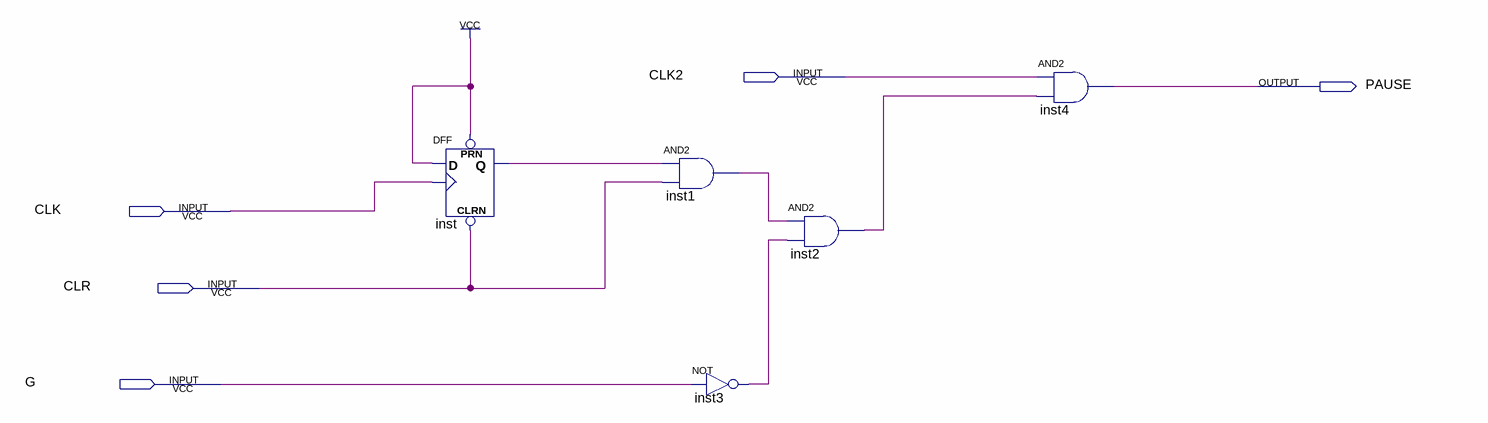
[diagram p0: schematic sheet]
// Quartus schematic maichong.bdf as structural Verilog: 5 symbols, 5 pins
module maichong (
  input  CLK2,
  input  CLK,
  input  CLR,
  input  G,
  output PAUSE
);

  wire inst1_out, inst2_out, inst3_out, inst_q;

  DFF inst (.CLRN(CLR), .CLK(CLK), .D(1'b1), .PRN(1'b1), .Q(inst_q));
  and inst1 (inst1_out, inst_q, CLR);
  not inst3 (inst3_out, G);
  and inst2 (inst2_out, inst1_out, inst3_out);
  and inst4 (PAUSE, CLK2, inst2_out);
endmodule
